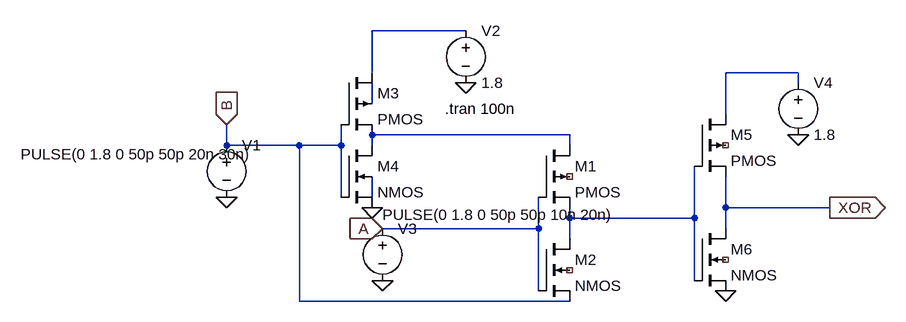
[diagram p0: schematic XNOR.asc]
XNOR.asc, the LTspice schematic file:
Version 4.1
SHEET 1 880 680
WIRE 144 -16 0 -16
WIRE 0 48 0 -16
WIRE 656 48 544 48
WIRE 656 64 656 48
WIRE 0 96 0 64
WIRE 544 112 544 48
WIRE 304 144 0 144
WIRE -224 160 -224 128
WIRE -112 160 -224 160
WIRE -48 160 -48 128
WIRE -48 160 -112 160
WIRE 0 160 0 144
WIRE 304 160 304 144
WIRE -48 240 -48 160
WIRE 0 240 0 208
WIRE 544 256 544 208
WIRE 704 256 544 256
WIRE 304 272 304 256
WIRE 496 272 496 192
WIRE 496 272 304 272
WIRE 256 288 256 240
WIRE 256 288 16 288
WIRE 544 288 544 256
WIRE 304 304 304 272
WIRE 496 368 496 272
WIRE 256 384 256 288
WIRE -112 400 -112 160
WIRE 304 400 -112 400
FLAG -224 240 0
FLAG -224 128 B
IOPIN -224 128 In
FLAG 144 64 0
FLAG 0 256 0
FLAG 16 368 0
FLAG 16 288 A
IOPIN 16 288 In
FLAG 704 256 XOR
IOPIN 704 256 Out
FLAG 656 144 0
FLAG 544 384 0
SYMBOL pmos4 256 160 R0
SYMATTR InstName M1
SYMBOL nmos4 256 304 R0
SYMATTR InstName M2
SYMBOL pmos4 -48 48 R0
SYMATTR InstName M3
SYMBOL nmos4 -48 160 R0
SYMATTR InstName M4
SYMBOL voltage -224 144 R0
WINDOW 3 -317 30 Left 2
WINDOW 123 0 0 Left 0
WINDOW 39 0 0 Left 0
SYMATTR InstName V1
SYMATTR Value PULSE(0 1.8 0 50p 50p 20n 30n)
SYMBOL voltage 144 -32 R0
WINDOW 123 0 0 Left 0
WINDOW 39 0 0 Left 0
SYMATTR InstName V2
SYMATTR Value 1.8
SYMBOL voltage 16 272 R0
WINDOW 3 0 -5 Left 2
WINDOW 123 0 0 Left 0
WINDOW 39 0 0 Left 0
SYMATTR InstName V3
SYMATTR Value PULSE(0 1.8 0 50p 50p 10n 20n)
SYMBOL pmos4 496 112 R0
SYMATTR InstName M5
SYMBOL nmos4 496 288 R0
SYMATTR InstName M6
SYMBOL voltage 656 48 R0
WINDOW 123 0 0 Left 0
WINDOW 39 0 0 Left 0
SYMATTR InstName V4
SYMATTR Value 1.8
TEXT 112 104 Left 2 !.tran 100n

The netlist it stands for:
* XNOR.asc
M1 N004 A N006 NC_01 PMOS
M2 N006 A B NC_02 NMOS
M3 N001 B N004 N003 PMOS
M4 N004 B 0 N005 NMOS
V1 B 0 PULSE(0 1.8 0 50p 50p 20n 30n)
V2 N001 0 1.8
V3 A 0 PULSE(0 1.8 0 50p 50p 10n 20n)
M5 N002 N006 XOR NC_03 PMOS
M6 XOR N006 0 NC_04 NMOS
V4 N002 0 1.8
.model NMOS NMOS
.model PMOS PMOS
.lib standard.mos
.tran 100n
.backanno
.end